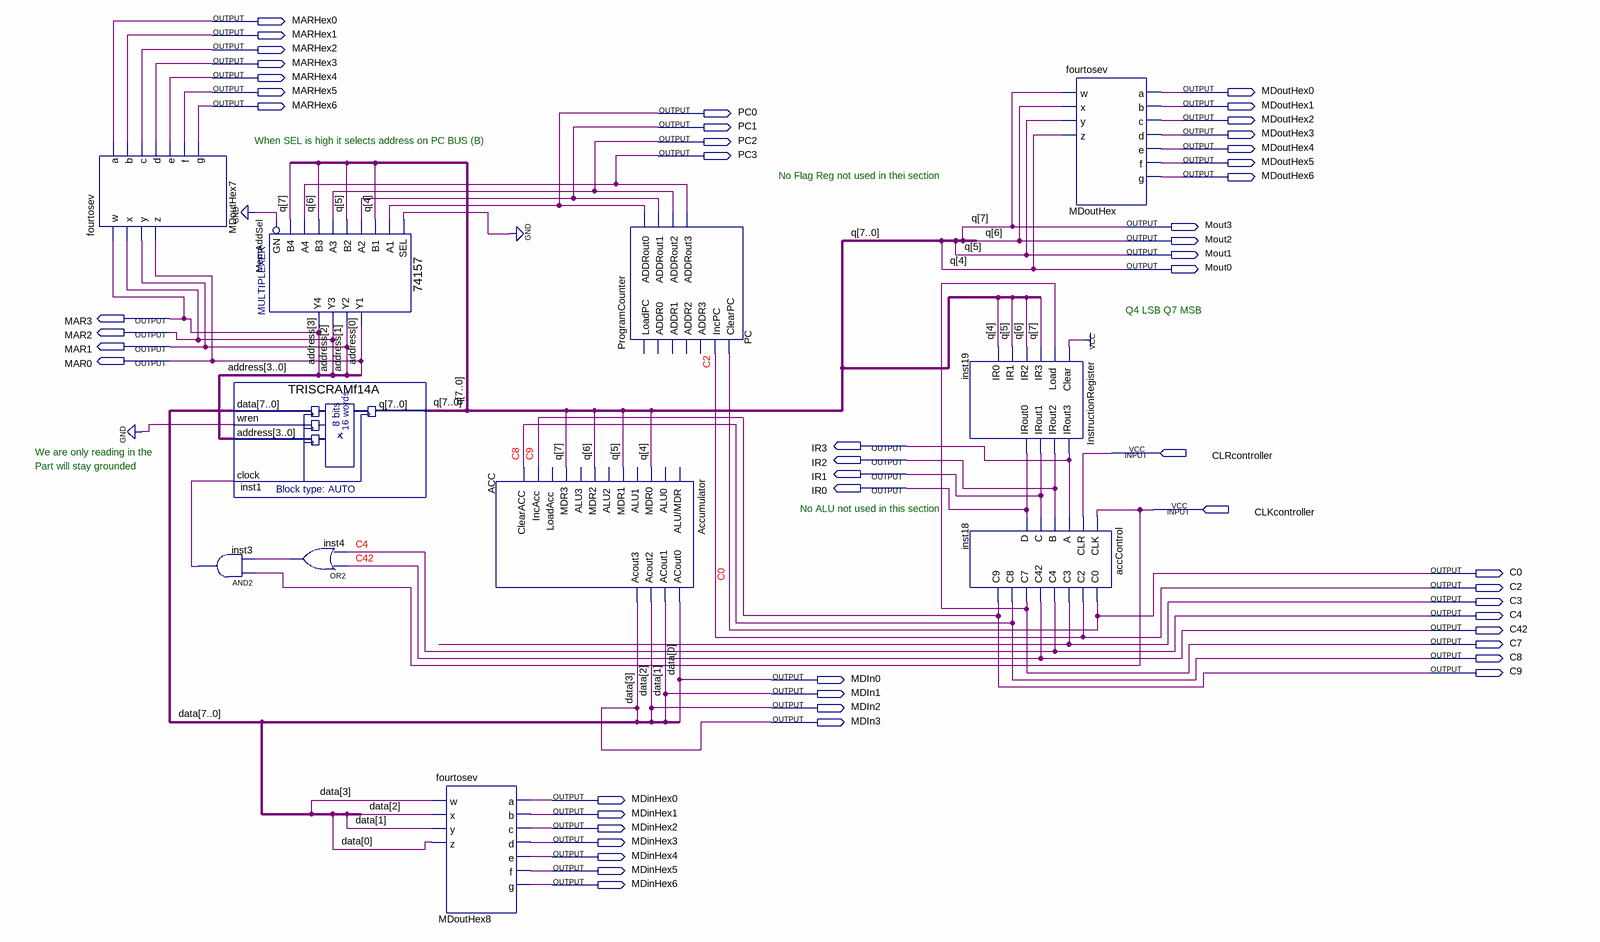
[diagram p0: schematic sheet]
// Quartus schematic partA.bdf as structural Verilog: 11 symbols, 51 pins
module partA (
  input  CLRcontroller,
  input  CLKcontroller,
  output MARHex0,
  output MARHex1,
  output MARHex2,
  output MARHex3,
  output MARHex4,
  output MARHex5,
  output MDoutHex0,
  output MARHex6,
  output MDoutHex1,
  output PC0,
  output MDoutHex2,
  output PC1,
  output MDoutHex3,
  output PC2,
  output MDoutHex4,
  output PC3,
  output MDoutHex5,
  output MDoutHex6,
  output Mout3,
  output Mout2,
  output Mout1,
  output Mout0,
  output MAR3,
  output MAR2,
  output MAR1,
  output MAR0,
  output IR3,
  output IR2,
  output IR1,
  output IR0,
  output C0,
  output C2,
  output C3,
  output C4,
  output C42,
  output C7,
  output C8,
  output C9,
  output MDIn0,
  output MDIn1,
  output MDIn2,
  output MDIn3,
  output MDinHex0,
  output MDinHex1,
  output MDinHex2,
  output MDinHex3,
  output MDinHex4,
  output MDinHex5,
  output MDinHex6
);

  wire inst3_out, inst4_out;
  wire [3:0] q;
  wire [7:4] data;

  fourtosev MDoutHex7 (
    .w(MAR3), .x(MAR2), .y(MAR1), .z(MAR0), .a(MARHex0), .b(MARHex1), .c(MARHex2), .d(MARHex3), .e(MARHex4),
    .f(MARHex5), .g(MARHex6));
  TRISCRAMf14A inst1 (
    .data({data, MDIn3, MDIn2, MDIn1, MDIn0}), .wren(1'b0), .address({MAR3, MAR2, MAR1, MAR0}),
    .clock(inst3_out), .q({Mout3, Mout2, Mout1, Mout0, q}));
  and inst3 (inst3_out, CLKcontroller, inst4_out);
  \74157  MemAddSel (
    .A1(PC0), .B1(Mout0), .SEL(1'b0), .B2(Mout1), .A3(PC2), .B3(Mout2), .A2(PC1), .B4(Mout3), .GN(1'b0),
    .A4(PC3), .Y2(MAR1), .Y1(MAR0), .Y4(MAR3), .Y3(MAR2));
  or inst4 (inst4_out, C42, C4);
  fourtosev MDoutHex8 (
    .w(MDIn3), .x(MDIn2), .y(MDIn1), .z(MDIn0), .a(MDinHex0), .b(MDinHex1), .c(MDinHex2), .d(MDinHex3),
    .e(MDinHex4), .f(MDinHex5), .g(MDinHex6));
  Accumulator ACC (
    .MDR0(Mout0), .MDR1(Mout1), .MDR2(Mout2), .MDR3(Mout3), .IncAcc(C9), .ClearACC(C8), .ACout0(MDIn0),
    .ACout1(MDIn1), .Acout2(MDIn2), .Acout3(MDIn3));  // open: ALU/MDR, ALU0, ALU1, ALU2, ALU3, LoadAcc
  ProgramCounter PC (
    .IncPC(C2), .ClearPC(C0), .ADDRout0(PC0), .ADDRout1(PC1), .ADDRout2(PC2), .ADDRout3(PC3));  // open: LoadPC, ADDR0, ADDR1, ADDR2, ADDR3
  InstructionRegister inst19 (
    .Clear(1'b1), .Load(C7), .IR3(Mout3), .IR2(Mout2), .IR1(Mout1), .IR0(Mout0), .IRout3(IR3), .IRout2(IR2),
    .IRout1(IR1), .IRout0(IR0));
  accControl inst18 (
    .CLK(CLKcontroller), .CLR(CLRcontroller), .A(IR3), .B(IR2), .C(IR1), .D(IR0), .C0(C0), .C2(C2), .C3(C3),
    .C4(C4), .C42(C42), .C7(C7), .C8(C8), .C9(C9));
  fourtosev MDoutHex (
    .w(Mout3), .x(Mout2), .y(Mout1), .z(Mout0), .a(MDoutHex0), .b(MDoutHex1), .c(MDoutHex2), .d(MDoutHex3),
    .e(MDoutHex4), .f(MDoutHex5), .g(MDoutHex6));

  // Other names for the same wires on the sheet: address[3:0] = {MAR3, MAR2, MAR1, MAR0};
  //   data[3:0] = {MDIn3, MDIn2, MDIn1, MDIn0}; q[7:4] = {Mout3, Mout2, Mout1, Mout0}

  // Notes on the sheet:
  //   When SEL is high it selects address on PC BUS (B)
  //   No Flag Reg not used in thei section
  //   Q4 LSB Q7 MSB
  //   We are only reading in the
  //   Part will stay grounded 
  //   No ALU not used in this section
endmodule
